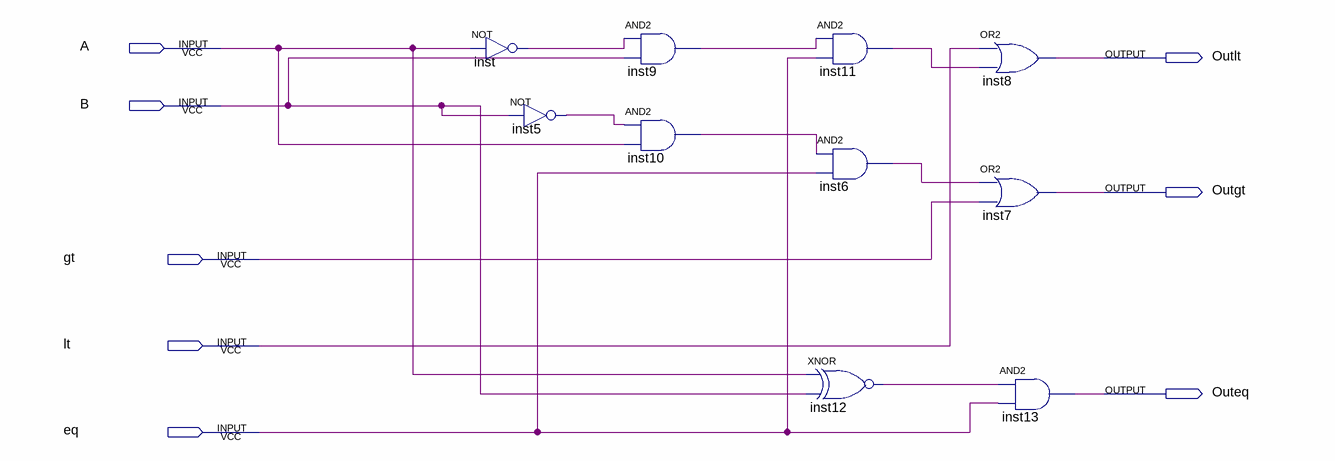
[diagram p0: schematic sheet]
// Quartus schematic comparator.bdf as structural Verilog: 10 symbols, 8 pins
module comparator (
  input  A,
  input  B,
  input  gt,
  input  lt,
  input  eq,
  output Outlt,
  output Outgt,
  output Outeq
);

  wire inst5_out, inst6_out, inst9_out, inst10_out, inst11_out, inst12_out, inst_out;

  not inst (inst_out, A);
  not inst5 (inst5_out, B);
  and inst9 (inst9_out, inst_out, B);
  and inst10 (inst10_out, inst5_out, A);
  and inst11 (inst11_out, inst9_out, eq);
  and inst6 (inst6_out, inst10_out, eq);
  xnor inst12 (inst12_out, A, B);
  or inst8 (Outlt, lt, inst11_out);
  or inst7 (Outgt, inst6_out, gt);
  and inst13 (Outeq, inst12_out, eq);
endmodule
